# EAGLE design Adafruit MEMENTO Camera LED Ring (EAGLE 9.6.2)
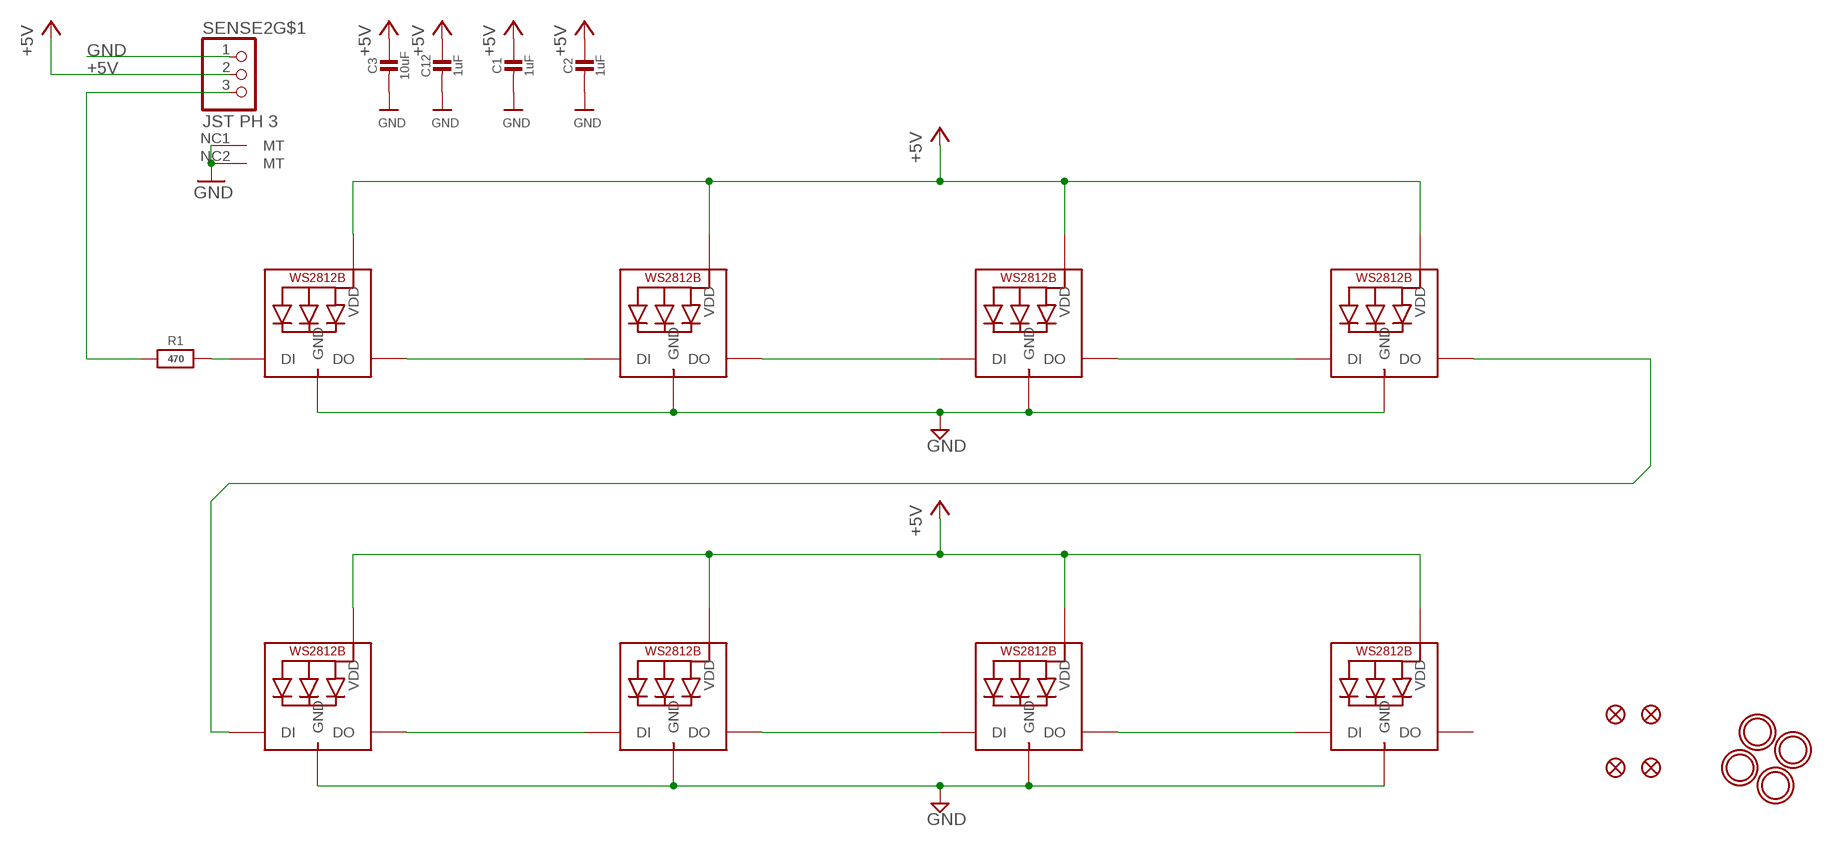
[diagram p0: schematic, sheet 1]

## Parts
C1  1uF  CAP_CERAMIC0603_NO  [0603-NO]
C2  1uF  CAP_CERAMIC0603_NO  [0603-NO]
C3  10uF  CAP_CERAMIC0805-NOOUTLINE  [0805-NO]
C12  1uF  CAP_CERAMIC0603_NO  [0603-NO]
FID1  FIDUCIAL_1MM  [FIDUCIAL_1MM]
FID2  FIDUCIAL_1MM  [FIDUCIAL_1MM]
FID3  FIDUCIAL_1MM  [FIDUCIAL_1MM]
FID4  FIDUCIAL_1MM  [FIDUCIAL_1MM]
LED1  WS2812B_5050N  [WS2812B-NARROW]
LED3  WS2812B_5050N  [WS2812B-NARROW]
LED5  WS2812B_5050N  [WS2812B-NARROW]
LED7  WS2812B_5050N  [WS2812B-NARROW]
LED9  WS2812B_5050N  [WS2812B-NARROW]
LED11  WS2812B_5050N  [WS2812B-NARROW]
LED13  WS2812B_5050N  [WS2812B-NARROW]
LED15  WS2812B_5050N  [WS2812B-NARROW]
R1  470  RESISTOR_0603_NOOUT  [0603-NO]
SENSE2  JST PH 3  CON_JST_PH_3PIN  [JSTPH3]
U$1  MOUNTINGHOLE3.0THIN  [MOUNTINGHOLE_3.0_PLATEDTHIN]
U$2  MOUNTINGHOLE3.0THIN  [MOUNTINGHOLE_3.0_PLATEDTHIN]
U$3  MOUNTINGHOLE3.0THIN  [MOUNTINGHOLE_3.0_PLATEDTHIN]
U$4  MOUNTINGHOLE3.0THIN  [MOUNTINGHOLE_3.0_PLATEDTHIN]

## Nets
+5V: C1.1 C2.1 C3.1 C12.1 LED1.1-VDD(VDD) LED3.1-VDD(VDD) LED5.1-VDD(VDD) LED7.1-VDD(VDD) LED9.1-VDD(VDD) LED11.1-VDD(VDD) LED13.1-VDD(VDD) LED15.1-VDD(VDD) SENSE2.2
GND: C1.2 C2.2 C3.2 C12.2 LED1.3-GND(GND) LED3.3-GND(GND) LED5.3-GND(GND) LED7.3-GND(GND) LED9.3-GND(GND) LED11.3-GND(GND) LED13.3-GND(GND) LED15.3-GND(GND) SENSE2.1 SENSE2.NC1(MT) SENSE2.NC2(MT)
IN: R1.1 SENSE2.3
N$2: LED1.2-DOUT(DO) LED3.4-DIN(DI)
N$3: LED3.2-DOUT(DO) LED5.4-DIN(DI)
N$4: LED5.2-DOUT(DO) LED7.4-DIN(DI)
N$5: LED9.2-DOUT(DO) LED11.4-DIN(DI)
N$6: LED11.2-DOUT(DO) LED13.4-DIN(DI)
N$7: LED13.2-DOUT(DO) LED15.4-DIN(DI)
N$20: LED7.2-DOUT(DO) LED9.4-DIN(DI)
N$21: LED1.4-DIN(DI) R1.2
Unconnected: LED15.2-DOUT(DO)

## Library data of the parts
C1-C3 C12 = microbuilder:CAP_CERAMIC: Ceramic Capacitors For new designs, use the packages preceded by an '_' character since they are more reliable: The following footprints should be used on most boards: _0402 - Standard footprint for regular board layouts _0603 - Standard footprint for regular board layouts _0805 - Standard footprint for regular board layouts _1206 - Standard footprint for regular board layouts For extremely tight-pitch boards where space is at a premium, the following 'micro-pitch' footprints can be used (smaller pads, no silkscreen outline, etc.): _0402MP - Micro-pitch footprint for very dense/compact boards _0603MP - Micro-pitch footprint for very dense/compact boards _0805MP - Micro-pitch footprint for very dense/compact boards _1206MP - Micro-pitch footprint for very dense/compact boards
FID1-FID4 = microbuilder:FIDUCIAL: Fiducial Alignment Points Various fiducial points for machine vision alignment.; BOM: EXCLUDE
LED1 LED3 LED5 LED7 LED9 LED11 LED13 LED15 = microbuilder:WS2812B
R1 = microbuilder:RESISTOR: Resistors For new designs, use the packages preceded by an '_' character since they are more reliable: The following footprints should be used on most boards: _0402 - Standard footprint for regular board layouts _0603 - Standard footprint for regular board layouts _0805 - Standard footprint for regular board layouts _1206 - Standard footprint for regular board layouts For extremely tight-pitch boards where space is at a premium, the following 'micro-pitch' footprints can be used (smaller pads, no silkscreen outline, etc.): _0402MP - Micro-pitch footprint for very dense/compact boards _0603MP - Micro-pitch footprint for very dense/compact boards _0805MP - Micro-pitch footprint for very dense/compact boards _1206MP - Micro-pitch footprint for very dense/compact boards
SENSE2 = adafruit_electromech:CON_JST_PH_3PIN
U$1-U$4 = adafruit_electromech:MOUNTINGHOLE: Mounting Hole For #2 screws (0.086"/2.18mm width, 0.094"/2.4mm hole) use 2.5mm; BOM: EXCLUDE

## Net classes
1 power: width 0.254 mm
2 lowpower: width 0.305 mm, drill 0.483 mm

## Board
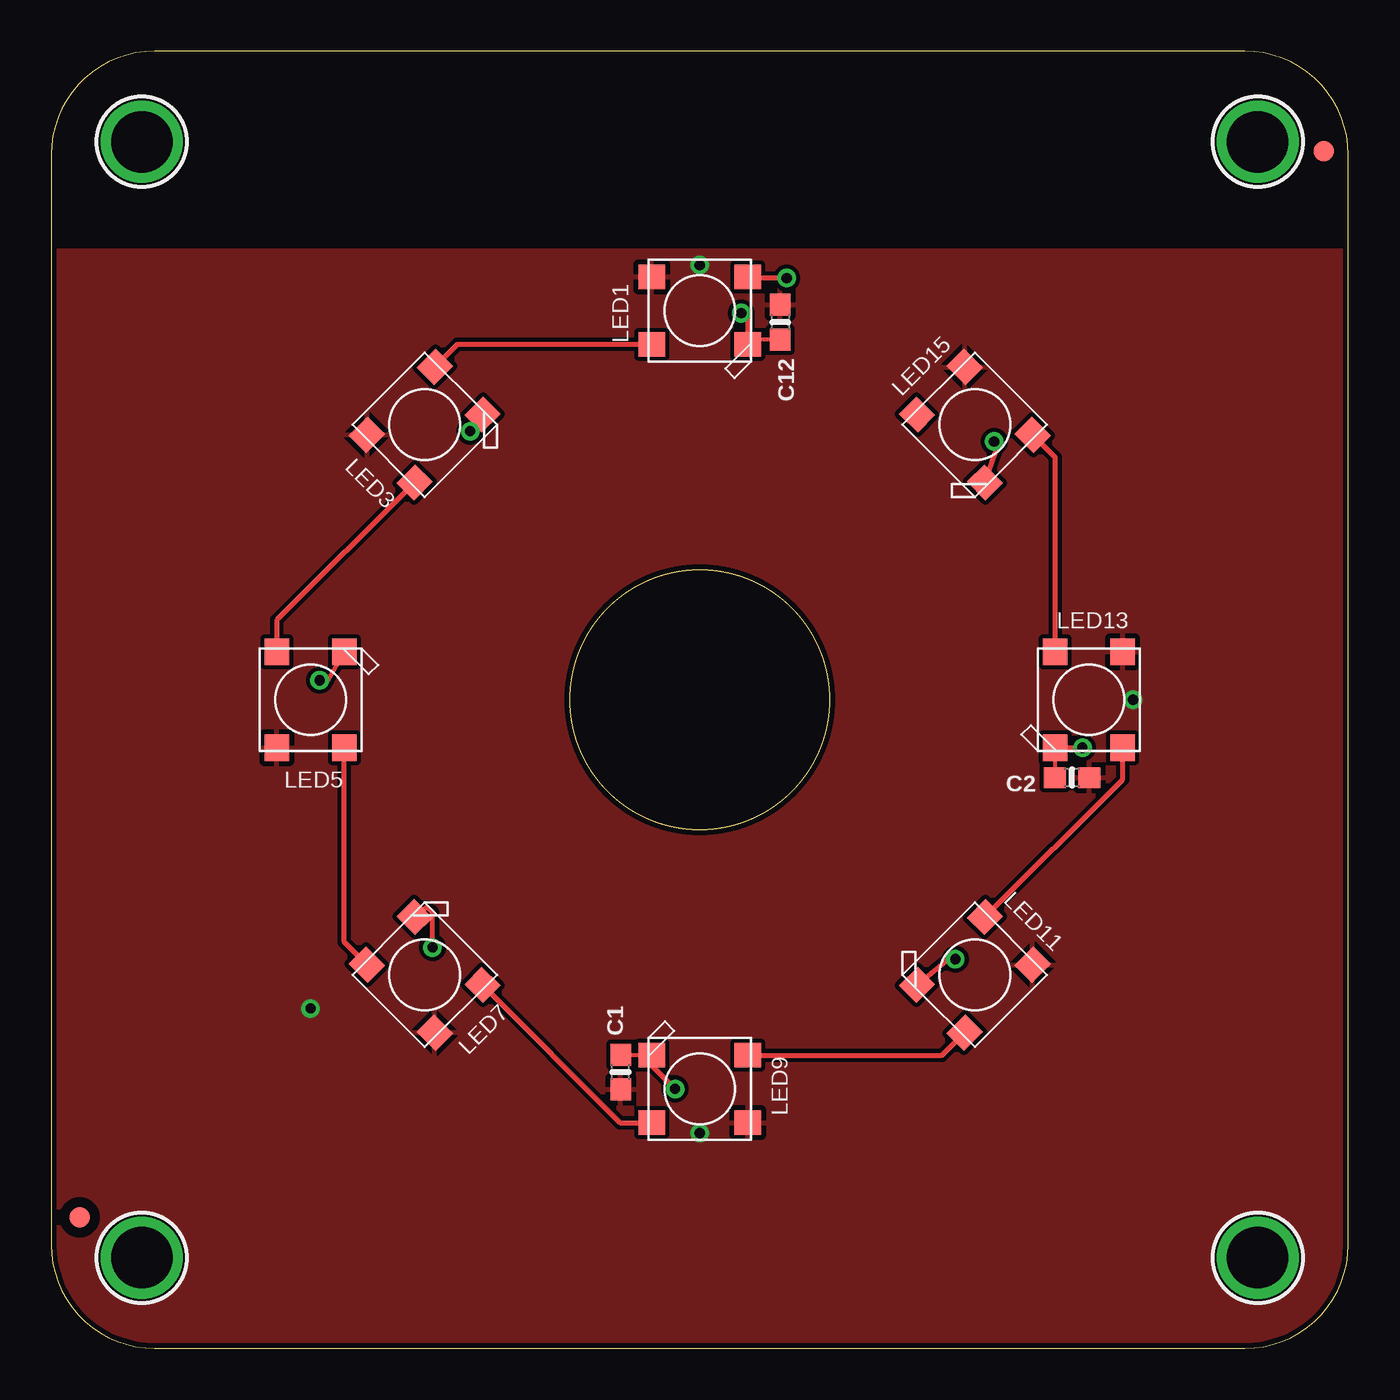
[diagram p1: board, top side]
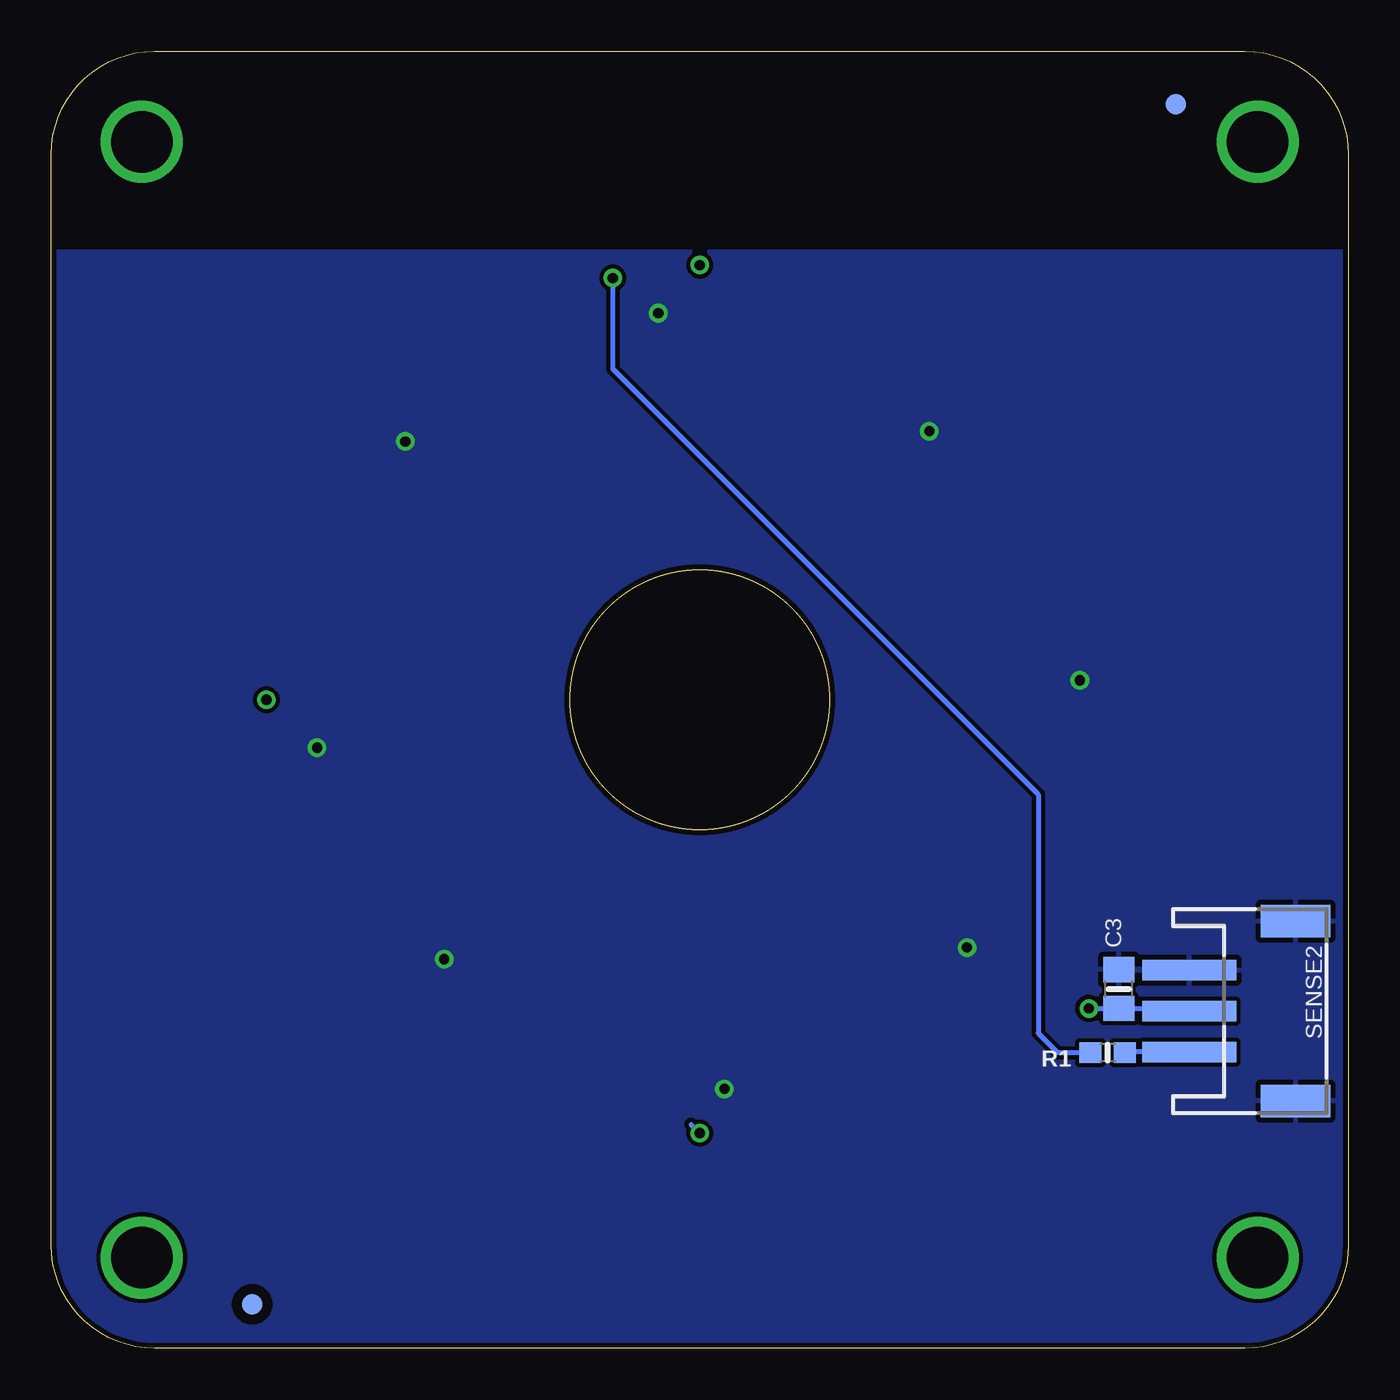
[diagram p2: board, bottom side, seen from below]

Size 63.5 x 63.5 mm. Coordinates in mm from the lower left corner, seen from the top.
Outline: 63.5,58.42 arc90 58.42,63.5 5.08,63.5 arc90 0,58.42 0,5.08 arc90 5.08,0 58.42,0 arc90 63.5,5.08 63.5,58.42
Outline: circle at 31.75,31.75 radius 6.35
Copper layers (1*16): Top 0.035mm / dielectric 1.5mm / Bottom 0.035mm
Design rules "adafruit *": minimum track width 8mil, minimum drill 15.5mil, track to track 8mil, track to pad 8mil, pad to pad 8mil, via to via 8mil, smd to smd 8mil, copper to edge 10mil, drill to drill 8mil, minimum pad ring 10mil, minimum via ring 8mil, stop-mask expansion 2mil, vias tented up to drill 20mil, thermal gap 10mil

### Footprints (pad centres in the part's own frame; a part is rotated, then mirrored left to right if it is on the bottom)
0603-NO = smd 1.075 x 1: 1 -0.85,0; 2 0.85,0
0805-NO = smd 1.24 x 1.5: 1 -0.95,0; 2 0.95,0
FIDUCIAL_1MM = smd 1 x 1: 1 0,0
WS2812B-NARROW = smd 1.3 x 1.2: 1-VDD 2.35,-1.65; 2-DOUT 2.35,1.65; 3-GND -2.35,1.65; 4-DIN -2.35,-1.65
JSTPH3 = smd 1 x 4.6: 1 -2,-2.7; 2 0,-2.7; 3 2,-2.7 | smd 1.6 x 3.4: NC1 -4.4,2.5; NC2 4.4,2.5
MOUNTINGHOLE_3.0_PLATEDTHIN = drill 3 pad 3.6: P$1 0,0

### Placement (x,y rotation side)
C1  27.88,13.53 90 top
C2  49.97,27.94 180 top
C3  11.24,17.59 90 bottom
C12  35.69,50.23 270 top
FID1  1.4,6.41 0 top
FID2  62.29,58.61 0 top
FID3  8.45,60.9 0 bottom
FID4  53.66,2.16 0 bottom
LED1  31.75,50.8 180 top
LED3  18.29,45.21 225 top
LED5  12.7,31.75 270 top
LED7  18.29,18.29 315 top
LED9  31.75,12.7 0 top
LED11  45.21,18.29 45 top
LED13  50.8,31.75 90 top
LED15  45.21,45.21 135 top
R1  11.79,14.48 180 bottom
SENSE2  5.08,16.51 270 bottom
U$1  4.45,59.05 0 top
U$2  4.45,4.45 0 top
U$3  59.05,4.45 0 top
U$4  59.05,59.05 0 top
U$8  [MEMENTO_LED_BOT]  63.5,0 0 bottom
U$9  [MEMENTO_LED_TOP]  0,0 0 top

### Tracks (layer width: path | path; a pad name or v marks a point on that pad's centre or on a via)
+5V  (via drill 0.5)
  Bottom 0.254: SENSE2.2 7.91,16.64 v12.7,16.64 C3.1 | 32.17,10.96 v31.75,10.54
  other vias: 31.75,53.02 52.96,31.75
  pour Top: 0,53.72 63.5,53.72 63.5,0 0,0
GND  (via drill 0.5)
  Top 0.203: LED9.3-GND 27.9,14.35 C1.2 | LED13.3-GND 49.12,29.38 C2.2 | C12.2 34.2,49.38 34.1,49.28
  Top 0.254: v13.14,32.7 13.53,32.7 LED5.3-GND | LED3.3-GND 20.81,44.9 v20.51,44.9 | LED1.3-GND 34.1,49.28 34.1,50.35 v33.78,50.67 | LED15.3-GND 46.23,43.86 46.23,44.32 v46.16,44.39 | LED13.3-GND v50.48,29.4 | v44.26,19.05 43.9,19.05 LED11.3-GND | v30.54,12.7 29.4,13.84 LED9.3-GND | LED7.3-GND 18.39,21.61 18.67,21.34 v18.67,19.62
  pour Bottom: 0,53.66 63.5,53.66 63.5,0 0,0
IN
  Bottom 0.254: SENSE2.3 10.9,14.51 R1.1
N$2
  Top 0.254: 29.27,49.02 LED1.2-DOUT 19.89,49.15 LED3.4-DIN
N$3
  Top 0.254: LED3.2-DOUT 11.05,35.64 LED5.4-DIN
N$4
  Top 0.254: LED5.2-DOUT | LED5.2-DOUT 14.4,29.34 | LED7.4-DIN 14.35,19.89 LED5.2-DOUT
N$5
  Top 0.254: LED9.2-DOUT 43.61,14.35 LED11.4-DIN
N$6
  Top 0.254: LED11.2-DOUT 52.45,27.86 LED13.4-DIN
N$7
  Top 0.254: 49.09,34.16 LED13.2-DOUT 49.15,43.61 LED15.4-DIN
N$20
  Top 0.254: LED7.2-DOUT 27.86,11.05 LED9.4-DIN
N$21  (via drill 0.5)
  Top 0.254: v36.01,52.39 34.16,52.39 LED1.4-DIN
  Bottom 0.254: R1.2 14.22,14.48 15.18,15.43 15.18,27.11 36.01,47.94 v36.01,52.39

### Text on the board
Pinguin_tBackup: out | IN | V+ | G | V+ | G
Pinguin_bBackup: Data / Out | Data / Input | NeoPixel | Ring 16 | Power | 5V DC | 16 x | Power & / Signal | Ground | SKC6812
214bmp: D:/SmartProjects/Snc/a4_bn_logo2.bmp